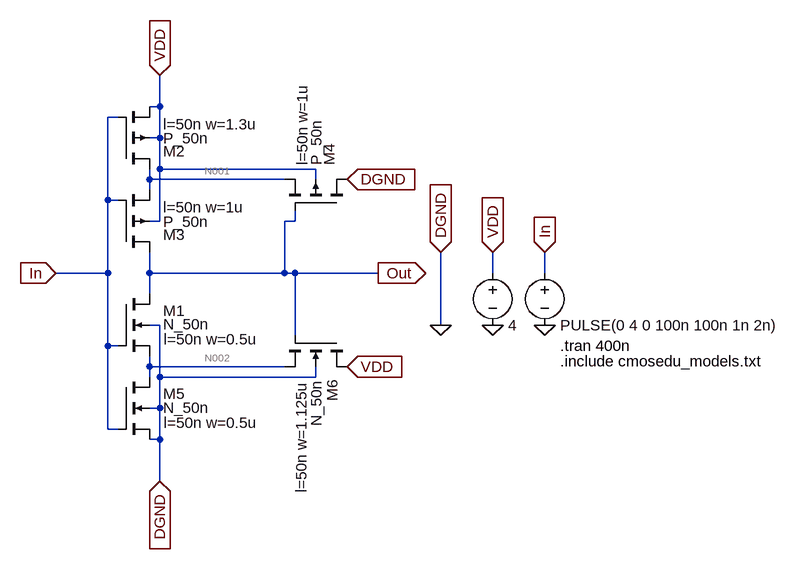
[diagram p0: schematic Schmitt_Trigger_SIM.asc]
Schmitt_Trigger_SIM.asc, the LTspice schematic file:
Version 4
SHEET 1 1168 756
WIRE 192 32 192 -16
WIRE 192 32 176 32
WIRE 128 48 112 48
WIRE 192 80 192 32
WIRE 192 80 176 80
WIRE 192 128 192 80
WIRE 432 128 192 128
WIRE 176 144 176 128
WIRE 384 144 176 144
WIRE 432 144 432 128
WIRE 176 160 176 144
WIRE 112 176 112 48
WIRE 128 176 112 176
WIRE 192 208 192 128
WIRE 192 208 176 208
WIRE 400 208 400 192
WIRE 400 208 384 208
WIRE 112 288 112 176
WIRE 112 288 32 288
WIRE 176 288 176 256
WIRE 384 288 384 208
WIRE 384 288 176 288
WIRE 400 288 384 288
WIRE 528 288 400 288
WIRE 704 288 704 256
WIRE 784 288 784 256
WIRE 176 320 176 288
WIRE 192 368 176 368
WIRE 624 368 624 256
WIRE 400 384 400 288
WIRE 112 400 112 288
WIRE 128 400 112 400
WIRE 176 432 176 416
WIRE 384 432 176 432
WIRE 176 448 176 432
WIRE 192 448 192 368
WIRE 432 448 432 432
WIRE 432 448 192 448
WIRE 192 496 192 448
WIRE 192 496 176 496
WIRE 112 528 112 400
WIRE 128 528 112 528
WIRE 192 544 192 496
WIRE 192 544 176 544
WIRE 192 608 192 544
FLAG 192 -16 VDD
IOPIN 192 -16 In
FLAG 32 288 In
IOPIN 32 288 In
FLAG 528 288 Out
IOPIN 528 288 Out
FLAG 192 608 DGND
IOPIN 192 608 In
FLAG 480 432 VDD
IOPIN 480 432 In
FLAG 480 144 DGND
IOPIN 480 144 In
FLAG 784 368 0
FLAG 704 368 0
FLAG 704 256 VDD
IOPIN 704 256 In
FLAG 784 256 In
IOPIN 784 256 In
FLAG 624 368 0
FLAG 624 256 DGND
IOPIN 624 256 In
SYMBOL nmos4 128 320 R0
WINDOW 0 69 26 Left 2
WINDOW 3 69 47 Left 2
WINDOW 123 70 70 Left 2
SYMATTR InstName M1
SYMATTR Value N_50n
SYMATTR Value2 l=50n w=0.5u
SYMBOL pmos4 128 128 M180
WINDOW 0 69 27 Left 2
WINDOW 3 69 47 Left 2
WINDOW 123 69 69 Left 2
SYMATTR InstName M2
SYMATTR Value P_50n
SYMATTR Value2 l=50n w=1.3u
SYMBOL pmos4 128 256 M180
WINDOW 0 69 27 Left 2
WINDOW 3 69 47 Left 2
WINDOW 123 69 69 Left 2
SYMATTR InstName M3
SYMATTR Value P_50n
SYMATTR Value2 l=50n w=1u
SYMBOL pmos4 480 192 M270
WINDOW 0 69 27 Left 2
WINDOW 3 69 47 Left 2
WINDOW 123 69 69 Left 2
SYMATTR InstName M4
SYMATTR Value P_50n
SYMATTR Value2 l=50n w=1u
SYMBOL nmos4 128 448 R0
WINDOW 0 69 26 Left 2
WINDOW 3 69 47 Left 2
WINDOW 123 70 70 Left 2
SYMATTR InstName M5
SYMATTR Value N_50n
SYMATTR Value2 l=50n w=0.5u
SYMBOL nmos4 480 384 R90
WINDOW 0 68 23 Left 2
WINDOW 3 69 47 Left 2
WINDOW 123 70 70 Left 2
SYMATTR InstName M6
SYMATTR Value N_50n
SYMATTR Value2 l=50n w=1.125u
SYMBOL voltage 704 272 R0
WINDOW 0 24 16 Invisible 2
WINDOW 123 0 0 Left 0
WINDOW 39 0 0 Left 0
SYMATTR InstName V1
SYMATTR Value 4
SYMBOL voltage 784 272 R0
WINDOW 0 24 16 Invisible 2
SYMATTR InstName V2
SYMATTR Value PULSE(0 4 0 100n 100n 1n 2n)
TEXT 808 424 Left 2 !.include cmosedu_models.txt
TEXT 808 400 Left 2 !.tran 400n

The netlist it stands for:
* Schmitt_Trigger_SIM.asc
M1 Out In N002 0 N_50n l=50n w=0.5u
M2 N001 In VDD VDD P_50n l=50n w=1.3u
M3 Out In N001 VDD P_50n l=50n w=1u
M4 0 Out N001 VDD P_50n l=50n w=1u
M5 N002 In 0 0 N_50n l=50n w=0.5u
M6 VDD Out N002 0 N_50n l=50n w=1.125u
V1 VDD 0 4
V2 In 0 PULSE(0 4 0 100n 100n 1n 2n)
.model NMOS NMOS
.model PMOS PMOS
.lib standard.mos
.include cmosedu_models.txt
.tran 400n
.backanno
.end

* Results of the author's LTspice run, read from the files saved beside the schematic
* Operating Point, zero values left out:
*   V(out) = 2.549 V
*   V(n002) = 2.057 V
*   V(n001) = 3.005 V
*   V(vdd) = 4 V
*   Id(M4) = -12.52 mA
*   Ig(M4) = 1.457 µA
*   Ib(M4) = 12.08 mA
*   Is(M4) = 447.4 µA
*   Id(M3) = -270.7 µA
*   Ig(M3) = -2.531 mA
*   Ib(M3) = 2.525 mA
*   Is(M3) = 275.9 µA
*   Id(M2) = -723.3 µA
*   Ig(M2) = -82.15 mA
*   Ib(M2) = 82.11 mA
*   Is(M2) = 758.5 µA
*   Id(M6) = 78.59 µA
*   Ig(M6) = -10.7 nA
*   Ib(M6) = -24.8 µA
*   Is(M6) = -53.78 µA
*   Id(M5) = 26.9 µA
*   Ig(M5) = -55.5 nA
*   Ib(M5) = -26.83 µA
*   Is(M5) = -6.749 nA
*   Id(M1) = 269.2 µA
*   Ig(M1) = -412 nA
*   Ib(M1) = -295.7 µA
*   Is(M1) = 26.88 µA
*   I(V2) = 84.68 mA
*   I(V1) = -97.55 mA
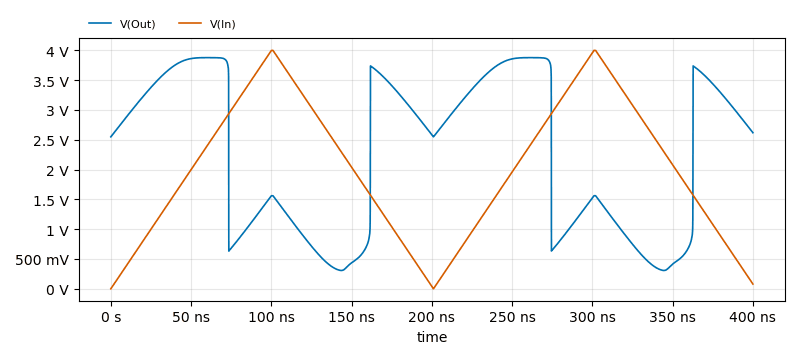
[diagram p1: Transient Analysis of Schmitt_Trigger_SIM.asc, plotted from the saved traces]
* Transient Analysis, 1 run:
*   V(Out): min 307.4 mV, max 3.878 V, average 2.277 V, rms 2.634 V, last 2.618 V
*   V(In): min 0 V, max 4 V, average 2.02 V, rms 2.327 V, last 80 mV